# EAGLE design WaterSensor-V01-Build015 (EAGLE 9.3.0)
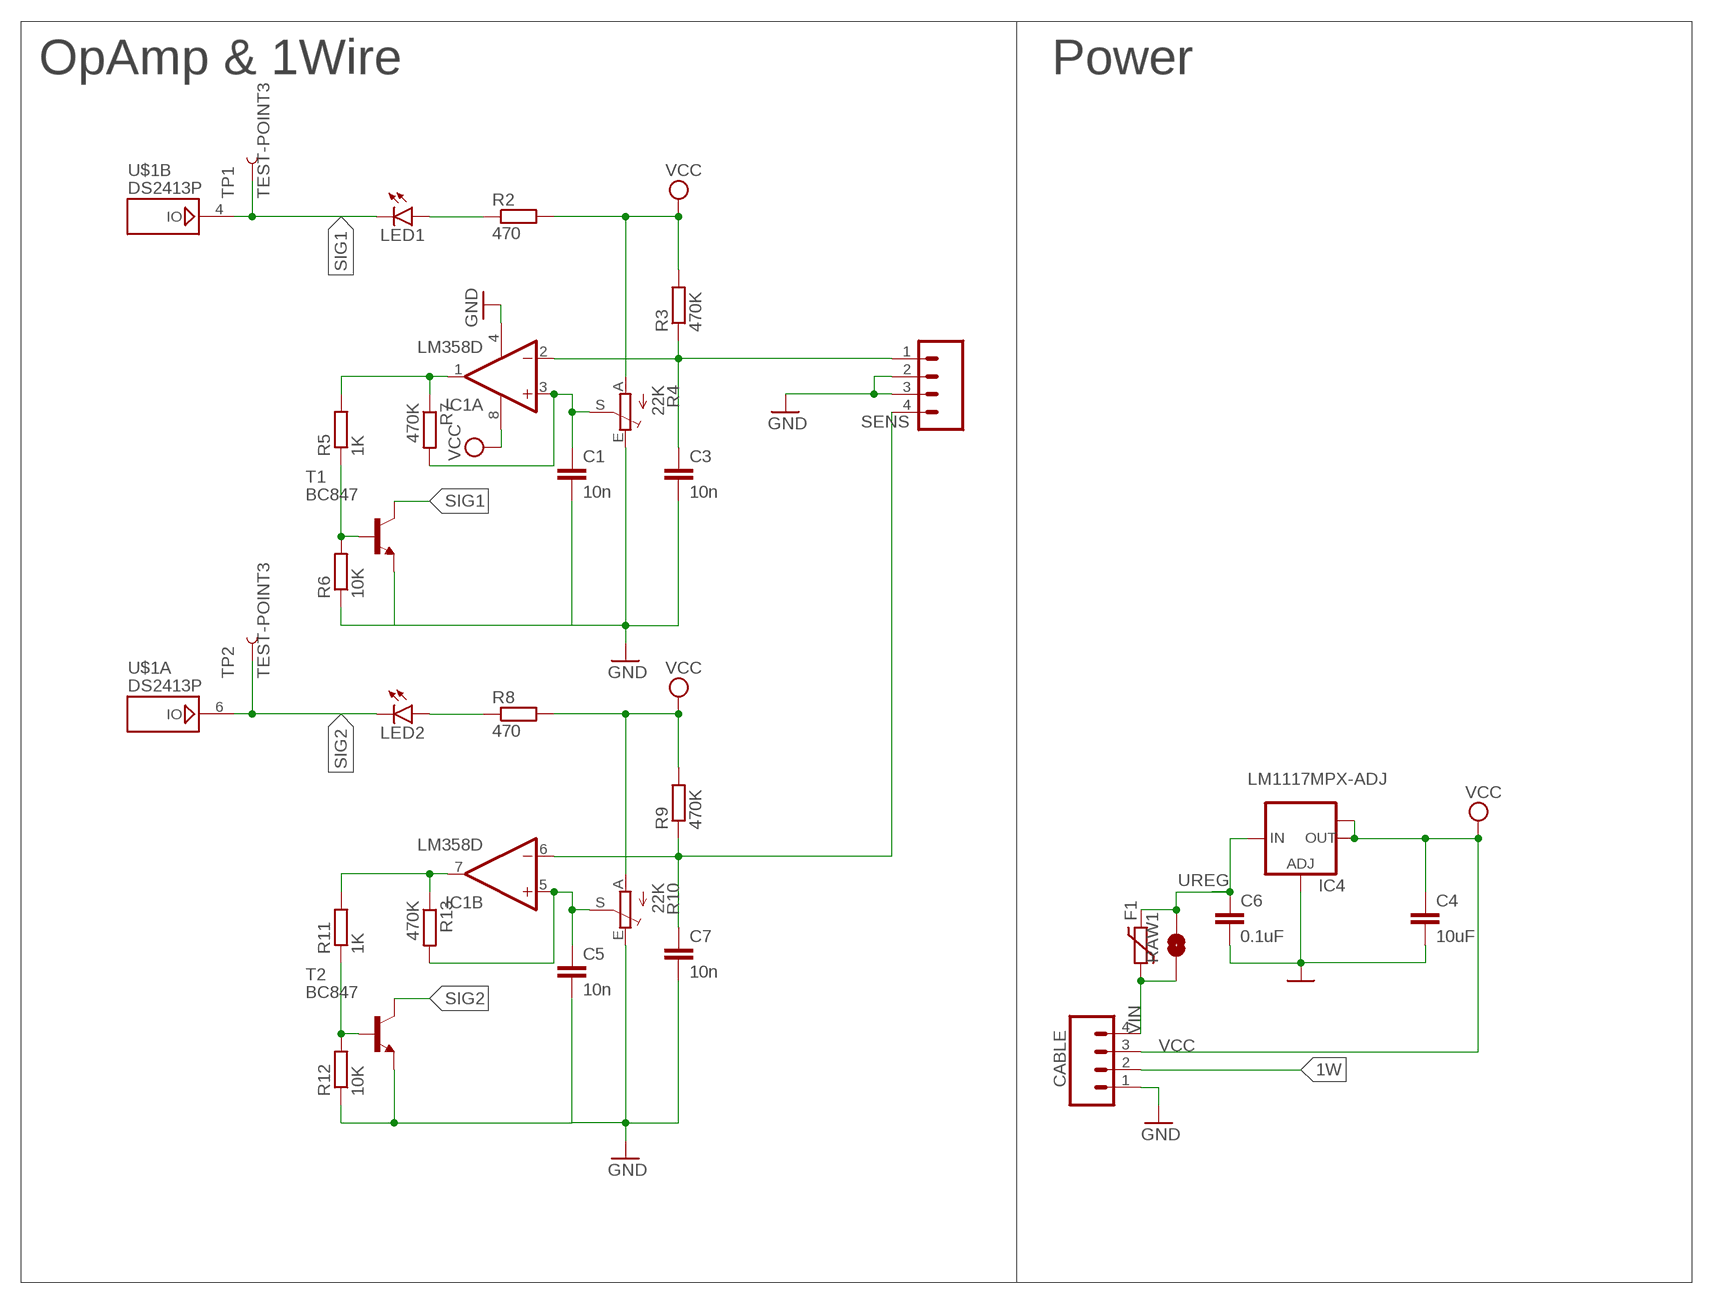
[diagram p0: schematic, sheet 1]

## Parts
C1  10n  C-EUC0805K  [C0805K]
C3  10n  C-EUC0805K  [C0805K]
C4  10uF  C-EUC1210  [C1210]
C5  10n  C-EUC0805K  [C0805K]
C6  0.1uF  C-EUC1206  [C1206]
C7  10n  C-EUC0805K  [C0805K]
CABLE  CONN_04LONGPADS  [1X04_LONGPADS]
F1  1812L  [1812L]
IC1  LM358D  [SO08]
IC4  LM1117MPX-ADJ  [SOT223]
LED1  LEDCHIP-LED0805  [CHIP-LED0805]
LED2  LEDCHIP-LED0805  [CHIP-LED0805]
R2  470  R-EU_R0805W  [R0805W]
R3  470K  R-EU_R0805W  [R0805W]
R4  22K  TRIM_EU-CA6V  [CA6V]
R5  1K  R-EU_R0805W  [R0805W]
R6  10K  R-EU_R0805W  [R0805W]
R7  470K  R-EU_R0805W  [R0805W]
R8  470  R-EU_R0805W  [R0805W]
R9  470K  R-EU_R0805W  [R0805W]
R10  22K  TRIM_EU-CA6V  [CA6V]
R11  1K  R-EU_R0805W  [R0805W]
R12  10K  R-EU_R0805W  [R0805W]
R13  470K  R-EU_R0805W  [R0805W]
RAW1  JUMPER-SMT_2_NO_SILK  [SMT-JUMPER_2_NO_SILK]
SENS  CONN_04LONGPADS  [1X04_LONGPADS]
T1  BC847  [SOT23]
T2  BC847  [SOT23]
TP1  TEST-POINT3  [PAD.03X.03]
TP2  TEST-POINT3  [PAD.03X.03]
U$1  DS2413P  [TSOC6]

## Nets
1W: CABLE.2
GND [PWR]: C1.2 C3.2 C4.2 C5.2 C6.2 C7.2 CABLE.1 IC1.4(P:V-) IC4.1(ADJ) R4.E R6.1 R10.E R12.1 SENS.2 SENS.3 T1.2(E) T2.2(E)
N$1: LED1.A R2.1
N$2: C3.1 IC1.2(A:-IN) R3.1 SENS.1
N$3: IC1.1(A:OUT) R5.2 R7.1
N$4: C1.1 IC1.3(A:+IN) R4.S R7.2
N$5: LED2.A R8.1
N$6: R5.1 R6.2 T1.1(B)
N$7: C7.1 IC1.6(B:-IN) R9.1 SENS.4
N$8: IC1.7(B:OUT) R11.2 R13.1
N$9: C5.1 IC1.5(B:+IN) R10.S R13.2
N$10: R11.1 R12.2 T2.1(B)
SIG1: LED1.C T1.3(C) TP1.P$1 U$1.4
SIG2: LED2.C T2.3(C) TP2.P$1 U$1.6
UREG [PWR]: C6.1 F1.P$1 IC4.3(IN) RAW1.2
VCC [PWR]: C4.1 CABLE.3 IC1.8(P:V+) IC4.2(OUT) IC4.TAB(OUT1) R2.2 R3.2 R4.A R8.2 R9.2 R10.A
VIN [PWR]: CABLE.4 F1.P$2 RAW1.1

## Notes on the sheet
- OpAmp & 1Wire | Power

## Power pins joined to a net without a drawn wire
1W: U$1.2
GND: U$1.1 U$1.5

## Library data of the parts
C1 C3 C5 C7 = rcl:C-EU: CAPACITOR, European symbol; SPICEPREFIX: C
C4 C6 = rcl:C-EU: CAPACITOR, European symbol
CABLE SENS = SparkFun-Connectors:CONN_04: Multi connection point. Often used as Generic Header-pin footprint for 0.1 inch spaced/style header connections On any of the 0.1 inch spaced packages, you can populate with these: Break Away Headers - Straight <https://www.sparkfun.com/products/116> (PRT-00116) Break Away Male Headers - Right Angle <https://www.sparkfun.com/products/553> (PRT-00553) Female Headers <https://www.sparkfun.com/products/115> (PRT-00115) Break Away Headers - Machine Pin <https://www.sparkfun.com/products/117> (PRT-00117) Break Away Female Headers - Swiss Machine Pin <https://www.sparkfun.com/products/743> (PRT-00743) For SCREWTERMINALS and SPRING TERMINALS visit here: Screw Terimnals on SparkFun.com <https://www.sparkfun.com/search/results?term=Screw+Terminals> (5mm/3.5mm/2.54mm spacing) This device is also useful as a general connection point to wire up your design to another part of your project. Our various solder wires solder well into these plated through hole pads. Hook-Up Wire - Assortment (Stranded, 22 AWG) <https://www.sparkfun.com/products/11375> (PRT-11375) Hook-Up Wire - Assortment (Solid Core, 22 AWG) <https://www.sparkfun.com/products/11367> (PRT-11367) View the entire wire category on our website here <https://www.sparkfun.com/categories/141> Special notes: Molex polarized connector foot print use with SKU : PRT-08231 with associated crimp pins and housings. 1MM SMD Version SKU: PRT-10208; PROD_ID: CONN-09696
F1 = ptc-littlefuse:1812L
IC1 = linear:LM358: OP AMP also LM158; LM258; LM2904 Source: http://cache.national.com/ds/LM/LM158.pdf
IC4 = lm1117:LM1117MPX-ADJ
LED1 LED2 = led:LED: LED OSRAM: - CHIPLED LG R971, LG N971, LY N971, LG Q971, LY Q971, LO R971, LY R971 LH N974, LH R974 LS Q976, LO Q976, LY Q976 LO Q996 - Hyper CHIPLED LW Q18S LB Q993, LB Q99A, LB R99A - SideLED LS A670, LO A670, LY A670, LG A670, LP A670 LB A673, LV A673, LT A673, LW A673 LH A674 LY A675 LS A676, LA A676, LO A676, LY A676, LW A676 LS A679, LY A679, LG A679 - Hyper Micro SIDELED® LS Y876, LA Y876, LO Y876, LY Y876 LT Y87S - SmartLED LW L88C, LW L88S LB L89C, LB L89S, LG L890 LS L89K, LO L89K, LY L89K LS L896, LA L896, LO L896, LY L896 - TOPLED LS T670, LO T670, LY T670, LG T670, LP T670 LSG T670, LSP T670, LSY T670, LOP T670, LYG T670 LG T671, LOG T671, LSG T671 LB T673, LV T673, LT T673, LW T673 LH T674 LS T676, LA T676, LO T676, LY T676, LB T676, LH T676, LSB T676, LW T676 LB T67C, LV T67C, LT T67C, LS T67K, LO T67K, LY T67K, LW E67C LS E67B, LA E67B, LO E67B, LY E67B, LB E67C, LV E67C, LT E67C LW T67C LS T679, LY T679, LG T679 LS T770, LO T770, LY T770, LG T770, LP T770 LB T773, LV T773, LT T773, LW T773 LH T774 LS E675, LA E675, LY E675, LS T675 LS T776, LA T776, LO T776, LY T776, LB T776 LHGB T686 LT T68C, LB T68C - Hyper Mini TOPLED® LB M676 - Mini TOPLED Santana® LG M470 LS M47K, LO M47K, LY M47K Source: http://www.osram.convergy.de LUXEON: - LUMILED® LXK2-PW12-R00, LXK2-PW12-S00, LXK2-PW14-U00, LXK2-PW14-V00 LXK2-PM12-R00, LXK2-PM12-S00, LXK2-PM14-U00 LXK2-PE12-Q00, LXK2-PE12-R00, LXK2-PE12-S00, LXK2-PE14-T00, LXK2-PE14-U00 LXK2-PB12-K00, LXK2-PB12-L00, LXK2-PB12-M00, LXK2-PB14-N00, LXK2-PB14-P00, LXK2-PB14-Q00 LXK2-PR12-L00, LXK2-PR12-M00, LXK2-PR14-Q00, LXK2-PR14-R00 LXK2-PD12-Q00, LXK2-PD12-R00, LXK2-PD12-S00 LXK2-PH12-R00, LXK2-PH12-S00 LXK2-PL12-P00, LXK2-PL12-Q00, LXK2-PL12-R00 Source: www.luxeon.com KINGBRIGHT: KA-3528ASYC Source: www.kingbright.com
R2 R3 R5-R9 R11-R13 = rcl:R-EU_: RESISTOR, European symbol; SPICEPREFIX: R
R4 R10 = pot:TRIM_EU-: POTENTIOMETER
RAW1 = SparkFun-Jumpers:JUMPER-SMT_2_NO: Normally open jumper This jumper has two pads in close proximity to each other. Apply solder to close the connection. Round pads are easier to solder for beginners, but are a lot larger. SparkFun Product that uses the round pads: SparkFun EL Sequencer <https://www.sparkfun.com/products/12781>
T1 T2 = transistor:BC847: NPN TRANSISTOR
TP1 TP2 = SparkFun-Connectors:TEST-POINT: SparkFun Test Points Bare copper test points for troubleshooting or In-Circuit-Testing. These are used by our Production team for verifying production board runs using pogo-pins on test beds. SparkFun Products: SparkFun LSM9DS1 Breakout <https://www.sparkfun.com/products/13284> SparkFun PSOC <https://www.sparkfun.com/products/13714> SparkFun Load Cell Amplifier <https://www.sparkfun.com/products/13879>
U$1 = 1wire:DS2413: Dual Channel Addressable Switch This chip is similar to the DS2405 chip, but provides two PIO channels with 20mA sinking capability and an on-resistance of 20Ohm for each open drain output. Up to 28V can be switched. Note: Both GND pins must be connected to 0V. Author: Jan Kandziora <jjj@gmx.de>

## Net classes
0 default: width 0.305 mm
1 PWR: width 0.406 mm, clearance 0.205 mm to class 0, clearance 0.205 mm

## Board
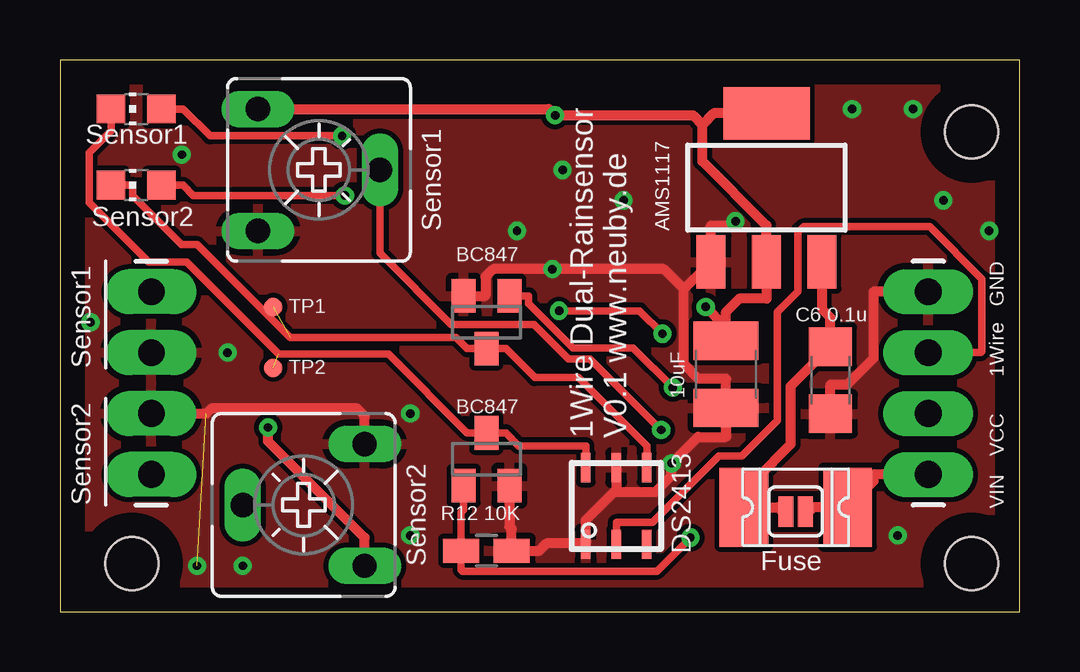
[diagram p1: board, top side]
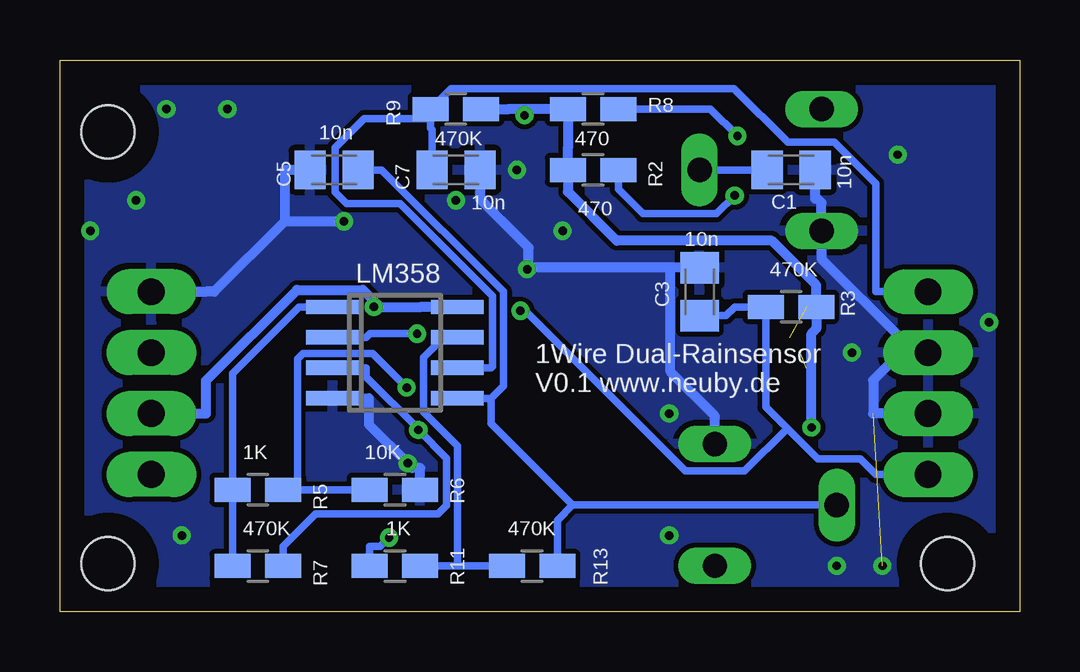
[diagram p2: board, bottom side, seen from below]

Size 40 x 23 mm. Coordinates in mm from the lower left corner, seen from the top.
Outline: 0,0 40,0 40,23 0,23 0,0
Copper layers (1*16): Top 0.035mm / dielectric 1.5mm / Bottom 0.035mm
Design rules "default": minimum track width 6mil, minimum drill 0.35mm, track to track 6mil, track to pad 6mil, pad to pad 6mil, via to via 6mil, smd to smd 6mil, copper to edge 40mil, drill to drill 6mil, minimum pad ring 10mil, minimum via ring 8mil, stop-mask expansion 4mil, vias tented up to drill 0mil, thermal gap 10mil
Holes 2.2 mm at 3,2 38,20 38,2

### Footprints (pad centres in the part's own frame; a part is rotated, then mirrored left to right if it is on the bottom)
C0805K = smd 1.3 x 1.6: 1 -1,0; 2 1,0
C1210 = smd 1.6 x 2.7: 1 -1.4,0; 2 1.4,0
C1206 = smd 1.6 x 1.8: 1 -1.4,0; 2 1.4,0
1X04_LONGPADS = drill 1.118 pad 1.88 long: 1 0,0; 2 2.54,0; 3 5.08,0; 4 7.62,0
1812L = smd 2.03 x 3.3: P$1 -2.16,0; P$2 2.16,0
SO08 = smd 0.6 x 2.2: 1 -1.905,-2.6; 2 -0.635,-2.6; 3 0.635,-2.6; 4 1.905,-2.6; 5 1.905,2.6; 6 0.635,2.6; 7 -0.635,2.6; 8 -1.905,2.6
SOT223 = smd 1.219 x 2.235: 1 -2.311,-3.099; 2 0,-3.099; 3 2.311,-3.099 | smd 3.6 x 2.2: TAB 0,3.099
CHIP-LED0805 = smd 1.2 x 1.2: A 0,-1.05; C 0,1.05
R0805W = smd 1.5 x 1: 1 -1.052,0; 2 1.052,0
CA6V = drill 1.016 long: A -2.54,-2.54; E 2.54,-2.54; S 0,2.54
SMT-JUMPER_2_NO_SILK = smd 0.635 x 1.27: 1 -0.406,0; 2 0.406,0
SOT23 = smd 1 x 1.4: 1 -0.95,-1.1; 2 0.95,-1.1; 3 0,1.1
PAD.03X.03 = smd 0.762 x 0.762: P$1 0,0
TSOC6 = smd 0.406 x 1.219: 1 -1.27,-1.6; 2 0,-1.6; 3 1.27,-1.6; 4 1.27,1.6; 5 0,1.6; 6 -1.27,1.6

### Placement (x,y rotation side)
C1  9.53,18.41 0 bottom
C3  13.34,13.34 90 bottom
C4  27.77,9.89 270 top
C5  28.57,18.41 180 bottom
C6  32.12,9.65 270 top
C7  23.5,18.41 0 bottom
CABLE  36.2,13.34 270 top
F1  30.67,4.35 0 top
IC1  26.04,10.79 270 bottom
IC4  29.45,17.68 0 top
LED1  3.17,17.78 90 top
LED2  3.17,20.95 90 top
R2  17.78,18.41 180 bottom
R3  9.53,12.7 0 bottom
R4  10.79,18.41 270 top
R5  31.75,5.08 180 bottom
R6  26.04,5.08 180 bottom
R7  31.75,1.91 0 bottom
R8  17.78,20.95 180 bottom
R9  23.5,20.95 0 bottom
R10  10.16,4.45 90 top
R11  26.04,1.91 0 bottom
R12  17.78,2.54 180 top
R13  20.32,1.91 0 bottom
RAW1  30.67,4.17 180 top
SENS  3.81,5.71 90 top
T1  17.78,12.06 180 top
T2  17.78,6.35 0 top
TP1  8.89,12.7 0 top
TP2  8.89,10.16 0 top
U$1  23.19,4.4 0 top

### Tracks (layer width: path | path; a pad name or v marks a point on that pad's centre or on a via)
1W
  Top 0.305: U$1.2 23.19,3.71 24.7,3.71 27.47,6.49 28.42,6.49 29.91,7.97 29.91,12.49 30.77,13.35 30.77,15.82 31,16.05 36.26,16.05 38.44,13.87 38.44,10.85 38.38,10.79 CABLE.2
GND  (via drill 0.35 pad 0.76)  (1 unrouted)
  Top 0.406: v28.16,16.27 28,16.1 27.14,16.1 IC4.1 26,13.44 | 26,13.44 25.17,14.28 v20.52,14.28 18.06,14.28 17.74,13.95 17.74,13.16 T1.2 | 23.19,4.98 24.83,4.98 25.5,5.65 v25.5,6.18 26.6,7.28 27.77,7.28 C4.2 27.77,9.7 26.62,9.7 26,10.32 26,13.44 | 23.19,4.98 23.09,4.98 21.92,3.82 21.92,2.97 21.92,2.84 | R10.E 12.7,8.15 12.39,8.46 6.31,8.46 6.1,8.26 SENS.2 | U$1.5 23.19,4.98 | T2.2 18.73,3.55 18.83,3.45 R12.1 19.99,2.54 20.29,2.84 21.92,2.84 | U$1.1 21.92,2.84 | C6.2 32.12,9.46 32.81,9.46 33.91,10.56 33.91,13.34 CABLE.1
  Bottom 0.406: 14.54,14.34 14.54,10 12.7,8.15 R10.E | 14.54,14.34 20.46,14.34 | C3.2 14.54,14.34 | v20.52,14.28 20.46,14.34 | 20.46,14.34 20.46,15.18 22.5,17.21 C7.2 | 30.63,16.27 33.57,13.34 33.91,13.34 CABLE.1 | 30.63,16.27 30.63,18.41 C5.2 | v28.16,16.27 30.63,16.27 | IC1.4 27.13,8.89 27.13,7.81 v25.5,6.18 25.31,5.99 24.98,5.99 R6.1 | 4.95,10.79 4.95,11.4 8.26,14.71 R4.E 8.26,17.05 8.42,17.21 8.53,17.21 C1.2 | 4.95,10.79 6.1,9.65 6.1,8.26 SENS.2 | SENS.3 4.95,10.79
  other vias: 5.71,1.91 7.62,1.91 14.61,3.17 14.61,8.26 6.99,10.79 1.27,12.06 5.08,19.05 19.05,15.88 20.95,18.41 23.5,17.14 33.02,20.95 35.56,20.95 36.83,17.14 38.73,15.88 34.92,3.17
  pour Top: 0.64,0.64 0.64,22.23 39.37,22.23 39.37,0.64
  pour Bottom: 0.64,22.23 39.37,22.23 39.37,0.64 0.64,0.64
N$1  (via drill 0.35 pad 0.76)
  Top 0.305: LED1.A 5.13,17.78 5.56,17.35 v11.87,17.35
  Bottom 0.305: R2.1 16.73,17.61 15.7,16.59 12.64,16.59 v11.87,17.35
N$2  (via drill 0.35 pad 0.76)
  Top 0.305: v25.11,11.59 24.16,12.54 v20.8,12.54
  Bottom 0.305: 9.69,7.64 11.47,5.86 13.92,5.86 20.6,12.54 v20.8,12.54 | 9.69,7.64 10.58,8.54 R3.1 11.87,12.7 12.23,12.34 12.78,12.34 C3.1 | 9.69,7.64 8.4,6.36 6.64,6.36 5.99,5.71 SENS.1 | IC1.2 27.23,11.43 27.07,11.59 v25.11,11.59
N$3
  Bottom 0.305: IC1.1 30.04,12.7 32.8,9.94 R5.2 R7.1
N$4  (via drill 0.35 pad 0.76)
  Top 0.305: R4.S 13.34,14.95 16.31,11.98 19.75,11.98 21.2,10.54 22.09,10.54 v25.06,7.57
  Bottom 0.305: IC1.3 27.23,10.16 27.23,9.79 25.06,7.62 v25.06,7.57 23.88,6.39 23.88,4.43 24.23,4.07 29.34,4.07 30.7,2.71 R7.2 | R4.S C1.1
N$5  (via drill 0.35 pad 0.76)
  Top 0.305: v11.76,19.83 6.25,19.83 5.13,20.95 LED2.A
  Bottom 0.305: R8.1 12.88,20.95 v11.76,19.83
N$6  (via drill 0.35 pad 0.76)
  Top 0.305: v25.55,9.34 23.89,11 21.38,11 19.54,12.84 19.54,13.16 T1.1
  Bottom 0.305: 30.09,5.08 30.09,10.54 29.86,10.77 26.98,10.77 v25.55,9.34 | 30.09,5.08 29.64,5.08 R6.2 | R5.1 30.09,5.08
N$7
  Bottom 0.305: SENS.4 5.99,13.34 5.99,17.85 7.72,19.57 9.67,19.57 11.91,21.81 23.69,21.81 R9.1 24.55,20.55 | 24.55,20.55 27.32,20.55 28.53,19.34 28.53,17.49 28.05,17 25.83,17 21.97,13.15 21.97,10.22 22.03,10.16 IC1.6 | 24.55,20.55 24.55,20.15 24.5,20.1 24.5,19.52 C7.1
N$8
  Bottom 0.305: 23.42,1.91 R11.2 | R13.1 23.42,1.91 | 23.42,1.91 23.42,6.9 24.84,8.32 24.84,10.59 24,11.43 IC1.7
N$9
  Bottom 0.305: 22.03,8.89 21.51,9.41 21.51,13.34 26.59,18.41 26.62,18.41 C5.1 | 18.63,4.45 22.03,7.85 22.03,8.89 | 18.63,4.45 8.69,4.45 R10.S | R13.2 19.27,3.81 18.63,4.45 | IC1.5 22.03,8.89
N$10  (via drill 0.35 pad 0.76)
  Top 0.305: v26.28,3.08 24.88,1.68 16.78,1.68 16.73,1.74 R12.2 16.73,4.14 16.83,4.25 T2.1
  Bottom 0.305: R11.1 27.09,2.71 26.66,2.71 v26.28,3.08
SIG1  (1 unrouted)
  Top 0.305: U$1.4 24.46,6.92 21.62,9.75 19.8,9.75 18.59,10.96 T1.3 16.98,10.96 16.52,11.42 9.6,11.42 5.72,15.29 5.08,15.29 3.03,17.34 3.03,17.78 LED1.C
SIG2  (1 unrouted)
  Top 0.305: U$1.6 21.92,6.92 19.12,6.92 18.59,7.45 T2.3 16.98,7.45 13.69,10.74 9.12,10.74 5.27,14.58 3.69,14.58 1.22,17.05 1.22,19.14 2.12,20.05 LED2.C
UREG
  Top 0.406: 29.04,4.35 29.04,5.56 30.47,6.99 30.47,9.4 C6.1 32.12,12.26 31.76,12.62 IC4.3 | 29.04,4.35 29.93,4.35 30.11,4.17 RAW1.2 | F1.P$1 29.04,4.35
VCC  (via drill 0.35 pad 0.76)
  Top 0.406: 26.78,20.31 26.4,20.69 v20.64,20.69 20.37,20.95 R4.A | 26.78,20.31 27.24,20.77 IC4.TAB | 26.78,20.31 26.78,18.77 29.45,16.1 IC4.2 29.45,13.05 28.32,13.05 27.77,12.5 27.77,11.89 | 27.77,11.89 27.73,11.89 v26.92,12.7 | R10.A 12.7,3.08 8.67,7.1 v8.67,7.68 | C4.1 27.77,11.89
  Bottom 0.406: 20.64,20.95 21.28,20.95 R9.2 | 20.64,20.95 R8.2 18.83,19.32 18.83,18.87 R2.2 18.83,17.51 16.79,15.47 10.33,15.47 | 20.64,20.95 v20.64,20.69 | 10.33,15.47 8.47,13.61 R3.2 8.47,11.79 8.67,11.59 v8.67,7.68 | 10.33,15.47 | CABLE.3 33.91,8.26 33.91,9.63 30.12,13.41 27.37,13.41 26.92,12.96 v26.92,12.7 24.95,12.7 24.94,12.7 IC1.8
VIN
  Top 0.406: RAW1.1 31.23,4.17 31.41,4.35 F1.P$2 33.91,5.43 33.91,5.71 CABLE.4

### Text on the board
tNames: Sensor1 | Sensor2 | Sensor1 | AMS1117 | BC847 | GND | C6 0.1u | TP1 | 1Wire | Sensor1 | TP2 | 10uF | BC847 | VCC | 1Wire Dual-Rainsensor / V0.1 www.neuby.de | VIN | Sensor2 | R12 10K | Fuse | Sensor2 | DS2413
bNames: R8 | R9 | 10n | 10n | R2 | 470 | 470K | C7 | C5 | C1 | 470 | 10n | 10n | 470K | LM358 | C3 | R3 | 1Wire Dual-Rainsensor / V0.1 www.neuby.de | R6 | 10K | 1K | R5 | R13 | 470K | R11 | 1K | 470K | R7